# Altium project Final Project.PrjPcb
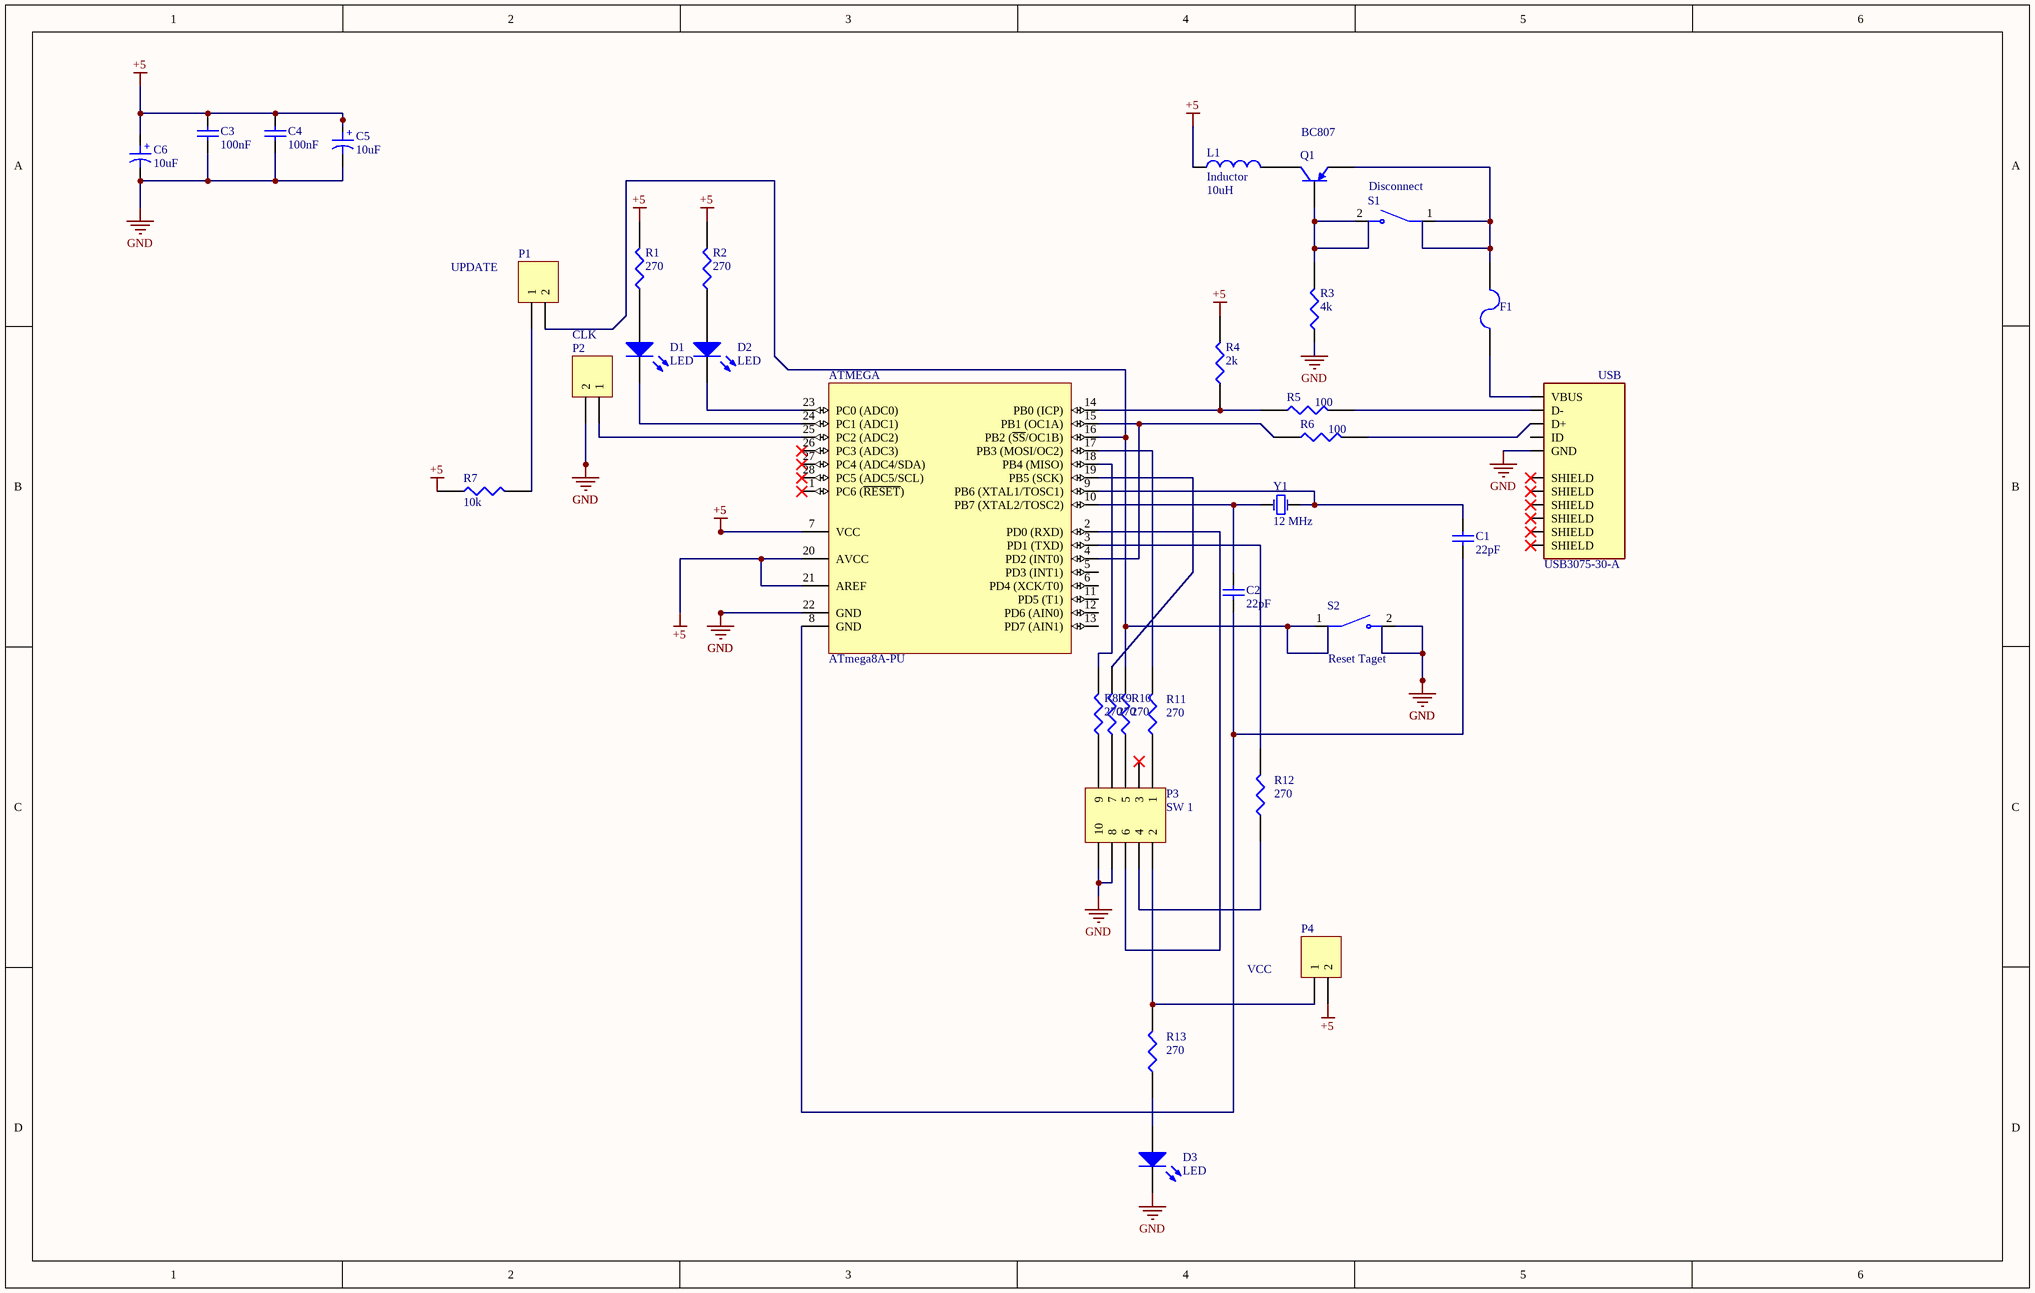
[diagram p0: Final Project.SchDoc]
1 sheet, 34 parts. Net scope: global (net labels, ports and power ports of the same name join across sheets).
Board files: Final Project.PcbDoc, PCB2.PcbDoc

## Sheet Final Project.SchDoc
size 381 x 241 mm; SheetNumber: 1; SheetTotal: 1

### Parts
ATMEGA  ATmega8A-PU  [28P3]
C1  22pF  [CAPC4817X12N]
C2  22pF  [CAPC4817X12N]
C3  100nF  [CAPC4817X12N]
C4  100nF  [CAPC4817X12N]
C5  10uF  [Cap electrolitic radial 10x20-5]
C6  10uF  [Cap electrolitic radial 10x20-5]
D1  LED  [My_LED3MM]
D2  LED  [My_LED3MM]
D3  LED  [My_LED3MM]
F1  F=1.0 A  [1206 FUSE]  (value not drawn)
L1  Inductor  value 10uH  [INDC1608L]
P1  UPDATE  [HDR1X2]
P2  CLK  [HDR1X2]
P3  SW 1  [HDR2X5]
P4  VCC  [HDR1X2]
Q1  BC807  [SOT23_BEC_N]
R1  value 270  [My_axial-0.4]  (hidden comment: 1k)
R2  value 270  [RES1206]  (hidden comment: 1k)
R3  value 4k  [My_axial-0.4]  (hidden comment: 1k)
R4  value 2k  [My_axial-0.4]  (hidden comment: 1k)
R5  value 100  [My_axial-0.4]  (hidden comment: 1k)
R6  value 100  [My_axial-0.4]  (hidden comment: 1k)
R7  10k  [My_axial-0.4]
R8  value 270  [My_axial-0.4]  (hidden comment: 1k)
R9  value 270  [My_axial-0.4]  (hidden comment: 1k)
R10  value 270  [My_axial-0.4]  (hidden comment: 1k)
R11  value 270  [My_axial-0.4]  (hidden comment: 1k)
R12  value 270  [My_axial-0.4]  (hidden comment: 1k)
R13  value 270  [My_axial-0.4]  (hidden comment: 1k)
S1  Disconnect  [SW_TL1107BF130WQ]
S2  Reset Taget  [SW_TL1107BF130WQ]
USB  USB3075-30-A  [GCT_USB3075-30-A]
Y1  12 MHz  [Crystal SMD]

### Nets
+5: ATMEGA.7(VCC) ATMEGA.20(AVCC) ATMEGA.21(AREF) C3.2 C4.2 C5.1 C6.1 L1.1 P4.2 R1.2 R2.2 R4.2 R7.1
GND: ATMEGA.22(GND) C3.1 C4.1 C5.2 C6.2 D3.K P2.2 P3.8 P3.10 R3.1 S2.2 USB.5(GND)
NetATMEGA_2: ATMEGA.2(PD0_(RXD)) P3.6
NetATMEGA_3: ATMEGA.3(PD1_(TXD)) R12.2
NetATMEGA_4: ATMEGA.4(PD2_(INT0)) ATMEGA.15(PB1_(OC1A)) R6.1
NetATMEGA_8: ATMEGA.8(GND) C1.2 C2.2
NetATMEGA_9: ATMEGA.9(PB6_(XTAL1/TOSC1)) C1.1 Y1.2(OSC2)
NetATMEGA_10: ATMEGA.10(PB7_(XTAL2/TOSC2)) C2.1 Y1.1(OSC1)
NetATMEGA_14: ATMEGA.14(PB0_(ICP)) R4.1 R5.1
NetATMEGA_16: ATMEGA.16(PB2_(~{SS}/OC1B)) P1.2 R10.2 S2.1
NetATMEGA_17: ATMEGA.17(PB3_(MOSI/OC2)) R11.2
NetATMEGA_18: ATMEGA.18(PB4_(MISO)) R8.2
NetATMEGA_19: ATMEGA.19(PB5_(SCK)) R9.2
NetATMEGA_23: ATMEGA.23(PC0_(ADC0)) D2.K
NetATMEGA_24: ATMEGA.24(PC1_(ADC1)) D1.K
NetATMEGA_25: ATMEGA.25(PC2_(ADC2)) P2.1
NetD1_A: D1.A R1.1
NetD2_A: D2.A R2.1
NetD3_A: D3.A R13.1
NetF1_1: F1.1 USB.1(VBUS)
NetF1_2: F1.2 Q1.2(E) S1.1
NetL1_2: L1.2 Q1.3(C)
NetP1_1: P1.1 R7.2
NetP3_1: P3.1 R11.1
NetP3_2: P3.2 P4.1 R13.2
NetP3_4: P3.4 R12.1
NetP3_5: P3.5 R10.1
NetP3_7: P3.7 R9.1
NetP3_9: P3.9 R8.1
NetQ1_1: Q1.1(B) R3.2 S1.2
NetR5_2: R5.2 USB.2(D-)
NetR6_2: R6.2 USB.3(D+)

Not connected (* = marked no-connect by the designer): ATMEGA 1(PC6_(~{RESET}))* 5(PD3_(INT1)) 6(PD4_(XCK/T0)) 11(PD5_(T1)) 12(PD6_(AIN0)) 13(PD7_(AIN1)) 26(PC3_(ADC3))* 27(PC4_(ADC4/SDA))* 28(PC5_(ADC5/SCL))*; P3 3*; USB 4(ID) S1(SHIELD)* S2(SHIELD)* S3(SHIELD)* S4(SHIELD)* S5(SHIELD)* S6(SHIELD)*

### Notes on the sheet
- (in symbol Cap ELECTROLITIC TOTAL SIZE) +

### Library data of the parts
ATMEGA = ATmega8A-PU: 8-bit AVR Microcontroller, 8KB Flash, 512 Bytes EEPROM, 1KB SRAM, 28-pin PDIP, Industrial Grade (-40°C to 85°C); Published: 1-Apr-2010; DatasheetVersion: revC, Jul-2009; PackageVersion: revB, Sep-2001; PackageReference: 28P3; Publisher: Altium Limited; PackageDescription: 28-lead (0.300"/7.62mm Wide) Plastic Dual Inline Package (PDIP); Supplier 1: Digi-Key; Supplier Part Number 1: ATMEGA8A-PU-ND; Supplier 2: Farnell; Supplier Part Number 2: 1748534; Supplier 3: Mouser; Supplier Part Number 3: 556-ATMEGA8A-PU; ComponentLink1Description: Manufacturer Link; ComponentLink1URL: http://www.atmel.com/products/avr/default.asp?; ComponentLink2Description: ATmega8A Datasheet; ComponentLink2URL: http://www.atmel.com/dyn/resources/prod_documents/doc8159.pdf; ComponentLink3Description: ATmega8A Summary; ComponentLink3URL: http://www.atmel.com/dyn/resources/prod_documents/8159S.pdf; ComponentLink4Description: Atmel.com Home; ComponentLink4URL: http://www.atmel.com
C1-C4 = CAP SMD 1206: CAP 1206; Designer: Abbas Basereh; Desc.: CAP SMD 1206; Data: 16-12-2016
C5 C6 = Cap ELECTROLITIC TOTAL SIZE: Cap electrolitic radial; Designer: Abbas Basereh; Data: 16-12-2016; Part. No: *; VALUE: 10uF
D1-D3 = LED: Typical INFRARED GaAs LED; Published: 8-Jun-2000; LatestRevisionDate: 08-Jul-2005; LatestRevisionNote: Mech Layer 1 removed.; Publisher: Altium Limited
F1 = Fuse SMD1206: SMD Fuses 1206; Designer: Abbas Basereh; Desc.: SMD Fuses 1206; Data: 16-12-2016
L1 = Inductor: Code_IEC: 1005; Published: 8-Jun-2000; LatestRevisionDate: 29-May-2009; LatestRevisionNote: IPC-7351 Footprint Added.; PackageReference: 0402-A; Publisher: Altium Limited; PackageDescription: Chip Inductor; Code_JEITA: 0402
P1 P2 P4 = Header 2: Header, 2-Pin; LatestRevisionDate: 17-Jul-2002; LatestRevisionNote: Re-released for DXP Platform.; Publisher: Altium Limited
P3 = Header 5X2: Header, 5-Pin, Dual row; LatestRevisionDate: 17-Jul-2002; LatestRevisionNote: Re-released for DXP Platform.; Publisher: Altium Limited
Q1 = BC807: PNP General-purpose Transistor; Published: 8-Jun-2000; LatestRevisionDate: 29-May-2009; LatestRevisionNote: IPC-7351 Footprint Added.; PackageVersion: Aug-1999; PackageReference: SOT-23B; Publisher: Altium Limited; PackageDescription: 3-Pin SOT-23 Package 0.95 mm Pitch, 2.4 mm Lead Span
R1-R13 = Res: resistor 1/4 wat
  R7: Value: 10k
S1 S2 = TL1107BF130WQ: SWITCH TACTILE SPST-NO 0.05A 12V; MF: E-Switch; Check_prices: https://www.snapeda.com/parts/TL1107BF130WQ/E-Switch/view-part/?ref=eda; SnapEDA_Link: https://www.snapeda.com/parts/TL1107BF130WQ/E-Switch/view-part/?ref=snap; Availability: In Stock; Purchase-URL: https://pricing.snapeda.com/search/part/TL1107BF130WQ/?ref=eda; Value: *; Price: None; MP: TL1107BF130WQ; Package: None
USB = USB3075-30-A: USB - micro B USB 2.0 Receptacle Connector 5 Position Surface Mount, Right Angle; Through Hole, 2.35mm profile, 5 Pins, Horizontal, Bottom mount; MF: Global Connector Technology; Check_prices: https://www.snapeda.com/parts/USB3075-30-A/Global+Connector+Technology/view-part/?ref=eda; Value: *; Availability: In Stock; Price: None; Package: None; MP: USB3075-30-A; SnapEDA_Link: https://www.snapeda.com/parts/USB3075-30-A/Global+Connector+Technology/view-part/?ref=snap
Y1 = XTAL: XTAL Crystal; Designer: ABBAS BASEREH; Design Date: 2017-1-3; ComponentLink1Description: Datasheet; ComponentLink2Description: Reference; Mounting Technology: Surface Mount\Through-Hole; Value: 12 MHz; Status: Unreleased